# Altium schematic sheet MCU.SchDoc
size A3; SheetNumber: 2; SheetTotal: 5
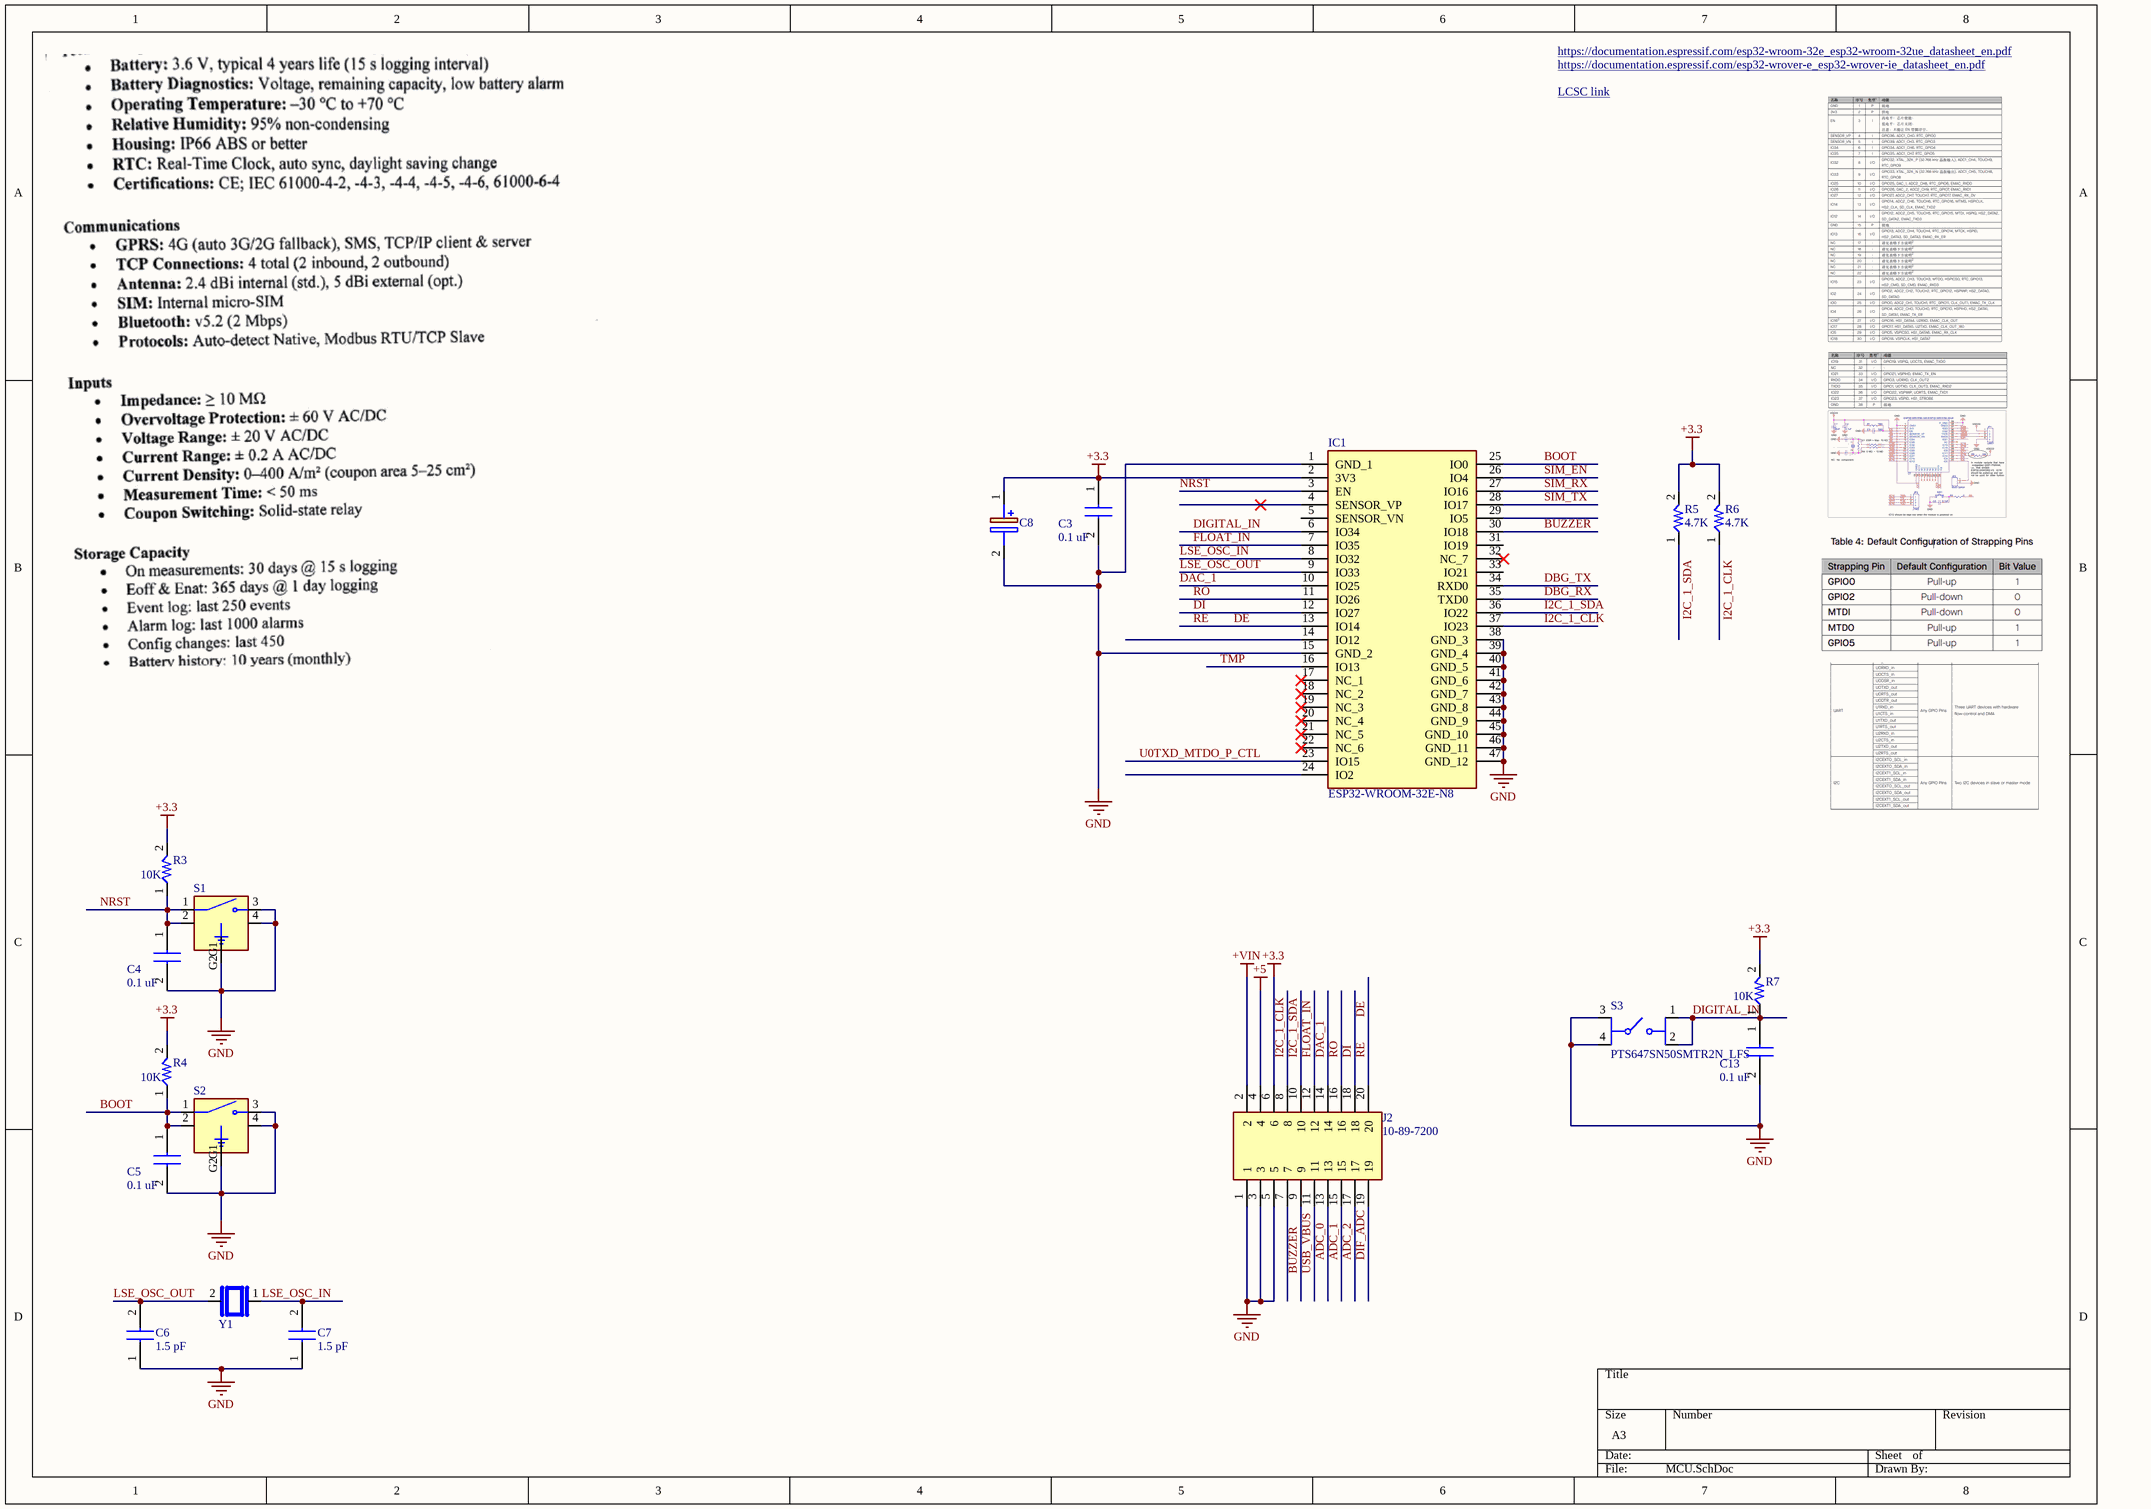
[diagram p0: MCU.SchDoc]

## Parts
C3  0.1 uF  [CAP0603]
C4  0.1 uF  [CAP0603]
C5  0.1 uF  [CAP0603]
C6  1.5 pF  [CAP0603]
C7  1.5 pF  [CAP0603]
C8  TPSD227K010R0100  [CAPPM7344X310N]  (value not drawn)
C13  0.1 uF  [CAP0603]
IC1  ESP32-WROOM-32E-N8  [ESP32WROOM32EN8]
J2  10-89-7200  [HDRV20W87P254_2X10_2553X508X864P]
R3  10K  [RES0603]
R4  10K  [RES0603]
R5  4.7K  [RES0603]
R6  4.7K  [RES0603]
R7  10K  [RES0603]
S1  PTS526_SMG15_SMTR2_LFS  [SW_PTS526_SMG15_SMTR2_LFS]  (value not drawn)
S2  PTS526_SMG15_SMTR2_LFS  [SW_PTS526_SMG15_SMTR2_LFS]  (value not drawn)
S3  PTS647SN50SMTR2N_LFS  [PTS647SK50SMTR2LFS]
Y1  CM8V-T1A-32.768KHZ-6PF-20PPM-TA-QC  [XTAL_CM8V-T1A-32.768KHZ-6PF-20PPM-TA-QC]  (value not drawn)

## Nets
+3.3: C3.1 C8.1(+) IC1.2(3V3) J2.6 R3.2 R4.2 R5.2 R6.2 R7.2
+5: J2.4
+VIN: J2.2
GND: C3.2 C4.2 C5.2 C6.1 C7.1 C8.2(-) C13.2 IC1.1(GND_1) IC1.15(GND_2) IC1.38(GND_3) IC1.39(GND_4) IC1.40(GND_5) IC1.41(GND_6) IC1.42(GND_7) IC1.43(GND_8) IC1.44(GND_9) IC1.45(GND_10) IC1.46(GND_11) IC1.47(GND_12) J2.1 J2.3 J2.5 S1.3(NO) S1.4(NO) S1.G2(GND) S2.3(NO) S2.4(NO) S2.G2(GND) S3.3(COM_1) S3.4(COM_2)
ADC_0: J2.13
ADC_1: J2.15
ADC_2: J2.17
BOOT: C5.1 IC1.25(IO0) R4.1 S2.1(COM) S2.2(COM)
BUZZER: IC1.30(IO18) J2.9
DAC_1: IC1.10(IO25) J2.14
DBG_RX: IC1.35(TXD0)
DBG_TX: IC1.34(RXD0)
DE: IC1.13(IO14) J2.20  [also labelled RE]
DI: IC1.12(IO27) J2.18
DIF_ADC: J2.19
DIGITAL_IN: C13.1 IC1.6(IO34) R7.1 S3.1(NO_1) S3.2(NO_2)
FLOAT_IN: IC1.7(IO35) J2.12
I2C_1_CLK: IC1.37(IO23) J2.8 R6.1
I2C_1_SDA: IC1.36(IO22) J2.10 R5.1
LSE_OSC_IN: C7.2 IC1.8(IO32) Y1.1
LSE_OSC_OUT: C6.2 IC1.9(IO33) Y1.2
NRST: C4.1 IC1.3(EN) R3.1 S1.1(COM) S1.2(COM)
RO: IC1.11(IO26) J2.16
SIM_EN: IC1.26(IO4)
SIM_RX: IC1.27(IO16)
SIM_TX: IC1.28(IO17)
TMP: IC1.16(IO13)
U0TXD_MTDO_P_CTL: IC1.23(IO15)
USB_VBUS: J2.11

Not connected (* = marked no-connect by the designer): IC1 4(SENSOR_VP)* 5(SENSOR_VN) 14(IO12) 17(NC_1)* 18(NC_2)* 19(NC_3)* 20(NC_4)* 21(NC_5)* 22(NC_6)* 24(IO2) 29(IO5) 31(IO19) 32(NC_7)* 33(IO21); J2 7; S1 G1(GND); S2 G1(GND)

## Notes on the sheet
- https://documentation.espressif.com/esp32-wroom-32e_esp32-wroom-32ue_datasheet_en.pdf
- https://documentation.espressif.com/esp32-wrover-e_esp32-wrover-ie_datasheet_en.pdf
- LCSC link <https://www.lcsc.com/product-detail/C701342.html?s_z=n_q_t_esp32&spm=wm.fly.bg.3.xh___wm.ssy.tc.0.tz&lcsc_vid=EVJdVVYDQlEPAgBWRwALVwJWFlQKUQJQQwdXUVRSQFIxVlNeRlBXXlJfTlRXVDsOAxUeFF5JWBYZEEoKFBINSQcJGk4dAgUUFAk%3D>

## Library data of the parts
C3-C7 C13 = CC0603KRX7R9BB104: Capacitor; Manufacturer_Name: YAGEO; Datasheet Link: https://componentsearchengine.com/Datasheets/2/CC0603KRX7R9BB104.pdf; Height: 0.9mm; Manufacturer_Part_Number: CC0603KRX7R9BB104; Mouser Part Number: 603-CC603KRX7R9BB104; Mouser Price/Stock: https://www.mouser.co.uk/ProductDetail/YAGEO/CC0603KRX7R9BB104?qs=vTakOoo5QyLvVCYM2ge8LQ%3D%3D; Arrow Part Number: CC0603KRX7R9BB104; Arrow Price/Stock: https://www.arrow.com/en/products/cc0603krx7r9bb104/yageo?utm_currency=USD&region=europe
C8 = TPSD227K010R0100: Capacitor Polarised; Manufacturer_Name: Kyocera AVX; Datasheet Link: https://componentsearchengine.com/Datasheets/2/TPSD227K010R0100.pdf; Height: 3.1mm; Manufacturer_Part_Number: TPSD227K010R0100; Mouser Part Number: 581-TPSD227K010R0100; Mouser Price/Stock: https://www.mouser.co.uk/ProductDetail/KYOCERA-AVX/TPSD227K010R0100?qs=VG9BpzG3P7aRGNUSeWjfzQ%3D%3D; Arrow Part Number: TPSD227K010R0100; Arrow Price/Stock: https://www.arrow.com/en/products/tpsd227k010r0100/avx
IC1 = ESP32-WROOM-32E-N8: Integrated Circuit; Manufacturer_Name: Espressif Systems; Datasheet Link: https://www.google.com/url?sa=t&rct=j&q=&esrc=s&source=web&cd=&ved=2ahUKEwjLw4ysybv2AhXFzIUKHZUbB64QFnoECCwQAQ&url=https%3A%2F%2Fwww.espressif.com%2Fsites%2Fdefault%2Ffiles%2Fdocumentation%2Fesp32-wroom-32e_esp32-wroom-32ue_datasheet_en.pdf&usg=AOvVaw1xSL; Height: 3.25mm; Manufacturer_Part_Number: ESP32-WROOM-32E-N8; Mouser Part Number: 356-ESP32WRM32E164PH; Mouser Price/Stock: https://www.mouser.co.uk/ProductDetail/Espressif-Systems/ESP32-WROOM-32E-N8?qs=Li%252BoUPsLEnsLnZW%252BGLgUhw%3D%3D
J2 = 10-89-7200: Connector; Manufacturer_Name: Molex; Datasheet Link: https://www.molex.com/content/dam/molex/molex-dot-com/products/automated/en-us/salesdrawingpdf/702/70280/010897200_sd.pdf?inline; Height: 8.64mm; Manufacturer_Part_Number: 10-89-7200; Mouser Part Number: 538-10-89-7200; Mouser Price/Stock: https://www.mouser.co.uk/ProductDetail/Molex/10-89-7200?qs=oWQp3ZoCHH25CPUgqQXm8A%3D%3D
R3-R7 = RES: Resistor; Manufacturer_Name: UNI-ROYAL(Uniroyal Elec); Manufacturer_Part_Number: 0603WAF1001T5E; Datasheet Link: https://datasheet.lcsc.com/szlcsc/Uniroyal-Elec-0603WAF1001T5E_C21190.pdf; Height: 0.55mm
S1 S2 = PTS526_SMG15_SMTR2_LFS: Tactile Switch SPST-NO Top Actuated Surface Mount; MP: PTS526 SMG15 SMTR2 LFS; MF: C&K; Availability: In Stock; SnapEDA_Link: https://www.snapeda.com/parts/PTS526%20SMG15%20SMTR2%20LFS/C%2526K/view-part/?ref=snap; Value: *; Package: None; Price: None; Purchase-URL: https://pricing.snapeda.com/search/part/PTS526 SMG15 SMTR2 LFS/?ref=eda; Check_prices: https://www.snapeda.com/parts/PTS526%20SMG15%20SMTR2%20LFS/C%2526K/view-part/?ref=eda
S3 = PTS647SN50SMTR2N_LFS: Switch (4-Pin Push); Manufacturer_Name: LITTELFUSE; Manufacturer_Part_Number: PTS647SN50SMTR2N LFS; Datasheet Link: https://www.ckswitches.com/media/2567/pts647.pdf
Y1 = CM8V-T1A-32.768KHZ-6PF-20PPM-TA-QC: Tuning Fork Crystal 32.768kHz in SMD 1.2 x 2.0mm package; MF: Micro Crystal; SnapEDA_Link: https://www.snapeda.com/parts/CM8V-T1A-32.768kHz-6pF-20PPM-TA-QC/Micro+Crystal/view-part/?ref=snap; Package: SMD-2 Micro Crystal; Value: *; MP: CM8V-T1A-32.768kHz-6pF-20PPM-TA-QC; Check_prices: https://www.snapeda.com/parts/CM8V-T1A-32.768kHz-6pF-20PPM-TA-QC/Micro+Crystal/view-part/?ref=eda